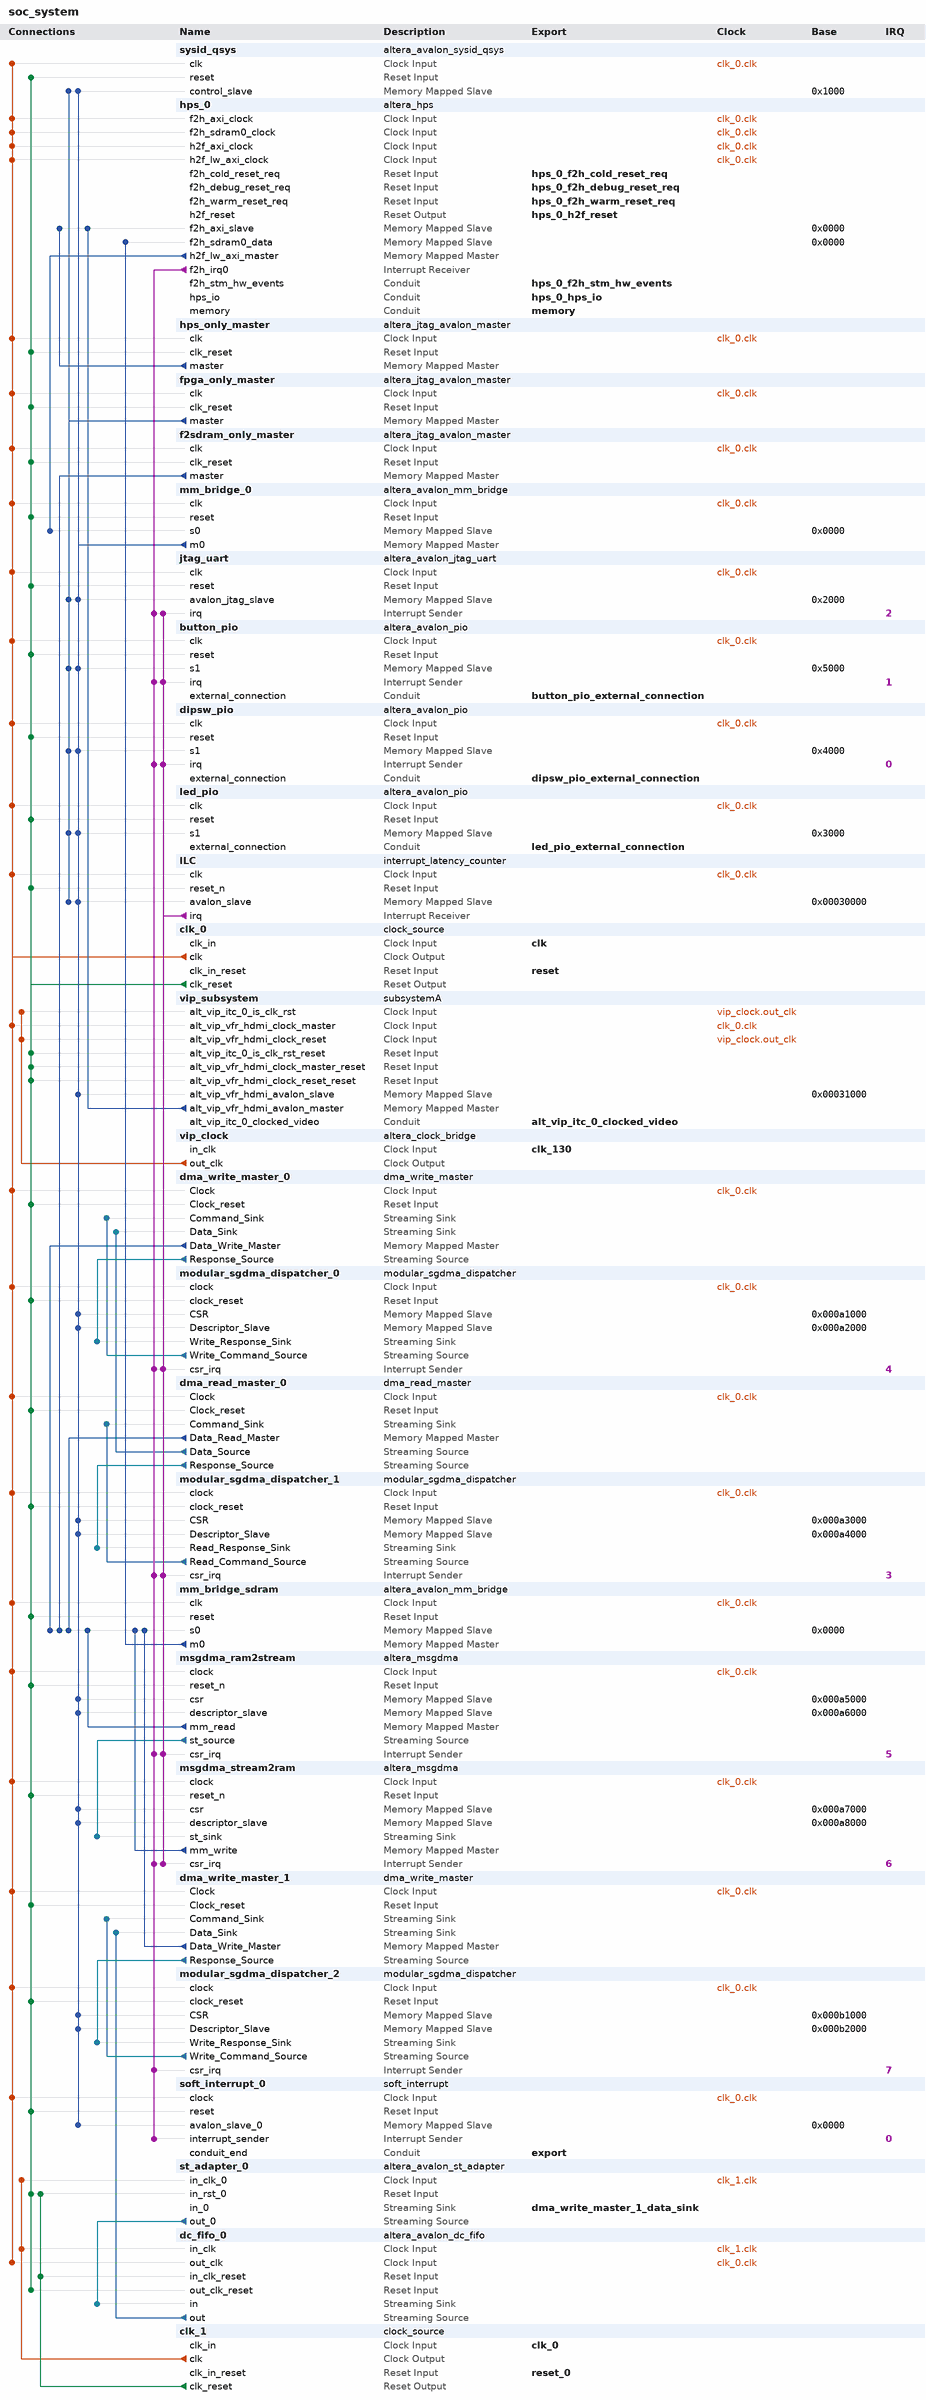
[diagram p0: system contents]
# Platform Designer (Qsys) system soc_system, Cyclone V 5CSEBA6U23I7
# Parameters at their usual value, and those the tool derives, are not listed.
package require -exact qsys 18.1
create_system soc_system
set_project_property DEVICE_FAMILY {Cyclone V}
set_project_property DEVICE 5CSEBA6U23I7

add_instance sysid_qsys altera_avalon_sysid_qsys 18.1
set_instance_parameter_value sysid_qsys id -1395322110

add_instance hps_0 altera_hps 18.1
set_instance_parameter_value hps_0 EMAC1_Mode RGMII
set_instance_parameter_value hps_0 EMAC1_PinMuxing {HPS I/O Set 0}
set_instance_parameter_value hps_0 F2SCLK_COLDRST_Enable true
set_instance_parameter_value hps_0 F2SCLK_DBGRST_Enable true
set_instance_parameter_value hps_0 F2SCLK_WARMRST_Enable true
set_instance_parameter_value hps_0 F2SDRAM_Type {Avalon-MM Bidirectional}
set_instance_parameter_value hps_0 F2SDRAM_Width 256
set_instance_parameter_value hps_0 F2SINTERRUPT_Enable true
set_instance_parameter_value hps_0 F2S_Width 3
set_instance_parameter_value hps_0 FPGA_PERIPHERAL_OUTPUT_CLOCK_FREQ_EMAC0_GTX_CLK 100
set_instance_parameter_value hps_0 FPGA_PERIPHERAL_OUTPUT_CLOCK_FREQ_EMAC0_MD_CLK 100.0
set_instance_parameter_value hps_0 FPGA_PERIPHERAL_OUTPUT_CLOCK_FREQ_EMAC1_GTX_CLK 100
set_instance_parameter_value hps_0 FPGA_PERIPHERAL_OUTPUT_CLOCK_FREQ_EMAC1_MD_CLK 100.0
set_instance_parameter_value hps_0 HPS_PROTOCOL DDR3
set_instance_parameter_value hps_0 I2C0_Mode I2C
set_instance_parameter_value hps_0 I2C0_PinMuxing {HPS I/O Set 0}
set_instance_parameter_value hps_0 I2C1_Mode I2C
set_instance_parameter_value hps_0 I2C1_PinMuxing {HPS I/O Set 0}
set_instance_parameter_value hps_0 LWH2F_Enable true
set_instance_parameter_value hps_0 MEM_BANKADDR_WIDTH 3
set_instance_parameter_value hps_0 MEM_CLK_FREQ 400.0
set_instance_parameter_value hps_0 MEM_COL_ADDR_WIDTH 10
set_instance_parameter_value hps_0 MEM_DQ_WIDTH 32
set_instance_parameter_value hps_0 MEM_DRV_STR RZQ/6
set_instance_parameter_value hps_0 MEM_ROW_ADDR_WIDTH 15
set_instance_parameter_value hps_0 MEM_RTT_NOM RZQ/6
set_instance_parameter_value hps_0 MEM_RTT_WR {Dynamic ODT off}
set_instance_parameter_value hps_0 MEM_TCL 7
set_instance_parameter_value hps_0 MEM_TFAW_NS 37.5
set_instance_parameter_value hps_0 MEM_TRAS_NS 35.0
set_instance_parameter_value hps_0 MEM_TRCD_NS 13.75
set_instance_parameter_value hps_0 MEM_TRFC_NS 300.0
set_instance_parameter_value hps_0 MEM_TRP_NS 13.75
set_instance_parameter_value hps_0 MEM_VENDOR Other
set_instance_parameter_value hps_0 MEM_WTCL 7
set_instance_parameter_value hps_0 QSPI_Mode N/A
set_instance_parameter_value hps_0 QSPI_PinMuxing Unused
set_instance_parameter_value hps_0 REF_CLK_FREQ 25.0
set_instance_parameter_value hps_0 S2FCLK_USER2CLK 4
set_instance_parameter_value hps_0 S2F_Width 2
set_instance_parameter_value hps_0 SDIO_Mode {4-bit Data}
set_instance_parameter_value hps_0 SDIO_PinMuxing {HPS I/O Set 0}
set_instance_parameter_value hps_0 SPIM1_Mode {Single Slave Select}
set_instance_parameter_value hps_0 SPIM1_PinMuxing {HPS I/O Set 0}
set_instance_parameter_value hps_0 STM_Enable true
set_instance_parameter_value hps_0 TIMING_BOARD_AC_SKEW 0.02
set_instance_parameter_value hps_0 TIMING_BOARD_AC_TO_CK_SKEW 0.0
set_instance_parameter_value hps_0 TIMING_BOARD_DQ_TO_DQS_SKEW 0.0
set_instance_parameter_value hps_0 TIMING_BOARD_MAX_CK_DELAY 0.6
set_instance_parameter_value hps_0 TIMING_BOARD_MAX_DQS_DELAY 0.6
set_instance_parameter_value hps_0 TIMING_BOARD_SKEW_BETWEEN_DQS 0.02
set_instance_parameter_value hps_0 TIMING_BOARD_SKEW_CKDQS_DIMM_MAX 0.01
set_instance_parameter_value hps_0 TIMING_BOARD_SKEW_CKDQS_DIMM_MIN -0.01
set_instance_parameter_value hps_0 TIMING_BOARD_SKEW_WITHIN_DQS 0.02
set_instance_parameter_value hps_0 TIMING_TDH 125
set_instance_parameter_value hps_0 TIMING_TDQSCK 400
set_instance_parameter_value hps_0 TIMING_TDQSQ 120
set_instance_parameter_value hps_0 TIMING_TDS 50
set_instance_parameter_value hps_0 TIMING_TIH 250
set_instance_parameter_value hps_0 TIMING_TIS 175
set_instance_parameter_value hps_0 TIMING_TQSH 0.38
set_instance_parameter_value hps_0 UART0_Mode {No Flow Control}
set_instance_parameter_value hps_0 UART0_PinMuxing {HPS I/O Set 0}
set_instance_parameter_value hps_0 USB1_Mode SDR
set_instance_parameter_value hps_0 USB1_PinMuxing {HPS I/O Set 0}
set_instance_parameter_value hps_0 desired_cfg_clk_mhz 100.0
set_instance_parameter_value hps_0 desired_qspi_clk_mhz 370.0

add_instance hps_only_master altera_jtag_avalon_master 18.1

add_instance fpga_only_master altera_jtag_avalon_master 18.1

add_instance f2sdram_only_master altera_jtag_avalon_master 18.1

add_instance mm_bridge_0 altera_avalon_mm_bridge 18.1
set_instance_parameter_value mm_bridge_0 ADDRESS_UNITS SYMBOLS
set_instance_parameter_value mm_bridge_0 ADDRESS_WIDTH 10
set_instance_parameter_value mm_bridge_0 DATA_WIDTH 32
set_instance_parameter_value mm_bridge_0 MAX_PENDING_RESPONSES 32
set_instance_parameter_value mm_bridge_0 USE_AUTO_ADDRESS_WIDTH 1

add_instance jtag_uart altera_avalon_jtag_uart 18.1
set_instance_parameter_value jtag_uart allowMultipleConnections true
set_instance_parameter_value jtag_uart simInteractiveOptions INTERACTIVE_ASCII_OUTPUT

add_instance button_pio altera_avalon_pio 18.1
set_instance_parameter_value button_pio bitClearingEdgeCapReg true
set_instance_parameter_value button_pio captureEdge true
set_instance_parameter_value button_pio direction Input
set_instance_parameter_value button_pio edgeType FALLING
set_instance_parameter_value button_pio generateIRQ true
set_instance_parameter_value button_pio irqType EDGE
set_instance_parameter_value button_pio width 2

add_instance dipsw_pio altera_avalon_pio 18.1
set_instance_parameter_value dipsw_pio bitClearingEdgeCapReg true
set_instance_parameter_value dipsw_pio captureEdge true
set_instance_parameter_value dipsw_pio direction Input
set_instance_parameter_value dipsw_pio edgeType ANY
set_instance_parameter_value dipsw_pio generateIRQ true
set_instance_parameter_value dipsw_pio irqType EDGE
set_instance_parameter_value dipsw_pio width 4

add_instance led_pio altera_avalon_pio 18.1
set_instance_parameter_value led_pio direction Output
set_instance_parameter_value led_pio resetValue 127
set_instance_parameter_value led_pio width 7

add_instance ILC interrupt_latency_counter 18.1
set_instance_parameter_value ILC CLOCK_RATE 100000000
set_instance_parameter_value ILC IRQ_PORT_CNT 7

add_instance clk_0 clock_source 18.1
set_instance_parameter_value clk_0 clockFrequency 100000000

add_instance vip_subsystem subsystemA 1.0

add_instance vip_clock altera_clock_bridge 18.1
set_instance_parameter_value vip_clock DERIVED_CLOCK_RATE 0
set_instance_parameter_value vip_clock EXPLICIT_CLOCK_RATE 0

add_instance dma_write_master_0 dma_write_master 18.1
set_instance_parameter_value dma_write_master_0 BURST_ENABLE 0
set_instance_parameter_value dma_write_master_0 DATA_WIDTH 256
set_instance_parameter_value dma_write_master_0 ERROR_ENABLE 0
set_instance_parameter_value dma_write_master_0 ERROR_WIDTH 8
set_instance_parameter_value dma_write_master_0 FIFO_DEPTH 32
set_instance_parameter_value dma_write_master_0 FIFO_SPEED_OPTIMIZATION 1
set_instance_parameter_value dma_write_master_0 FIX_ADDRESS_WIDTH 32
set_instance_parameter_value dma_write_master_0 GUI_BURST_WRAPPING_SUPPORT 0
set_instance_parameter_value dma_write_master_0 GUI_MAX_BURST_COUNT 2
set_instance_parameter_value dma_write_master_0 GUI_PROGRAMMABLE_BURST_ENABLE 0
set_instance_parameter_value dma_write_master_0 GUI_STRIDE_WIDTH 1
set_instance_parameter_value dma_write_master_0 LENGTH_WIDTH 32
set_instance_parameter_value dma_write_master_0 PACKET_ENABLE 1
set_instance_parameter_value dma_write_master_0 STRIDE_ENABLE 0
set_instance_parameter_value dma_write_master_0 TRANSFER_TYPE {Aligned Accesses}
set_instance_parameter_value dma_write_master_0 USE_FIX_ADDRESS_WIDTH 0

add_instance modular_sgdma_dispatcher_0 modular_sgdma_dispatcher 18.1
set_instance_parameter_value modular_sgdma_dispatcher_0 BURST_ENABLE 0
set_instance_parameter_value modular_sgdma_dispatcher_0 BURST_WRAPPING_SUPPORT 0
set_instance_parameter_value modular_sgdma_dispatcher_0 CSR_ADDRESS_WIDTH 3
set_instance_parameter_value modular_sgdma_dispatcher_0 DATA_FIFO_DEPTH 32
set_instance_parameter_value modular_sgdma_dispatcher_0 DATA_WIDTH 32
set_instance_parameter_value modular_sgdma_dispatcher_0 DESCRIPTOR_FIFO_DEPTH 128
set_instance_parameter_value modular_sgdma_dispatcher_0 ENHANCED_FEATURES 0
set_instance_parameter_value modular_sgdma_dispatcher_0 GUI_RESPONSE_PORT 2
set_instance_parameter_value modular_sgdma_dispatcher_0 MAX_BURST_COUNT 2
set_instance_parameter_value modular_sgdma_dispatcher_0 MAX_BYTE 1024
set_instance_parameter_value modular_sgdma_dispatcher_0 MAX_STRIDE 1
set_instance_parameter_value modular_sgdma_dispatcher_0 MODE 2
set_instance_parameter_value modular_sgdma_dispatcher_0 PREFETCHER_USE_CASE 0
set_instance_parameter_value modular_sgdma_dispatcher_0 PROGRAMMABLE_BURST_ENABLE 0
set_instance_parameter_value modular_sgdma_dispatcher_0 STRIDE_ENABLE 0
set_instance_parameter_value modular_sgdma_dispatcher_0 TRANSFER_TYPE {Aligned Accesses}

add_instance dma_read_master_0 dma_read_master 18.1
set_instance_parameter_value dma_read_master_0 BURST_ENABLE 0
set_instance_parameter_value dma_read_master_0 CHANNEL_ENABLE 0
set_instance_parameter_value dma_read_master_0 CHANNEL_WIDTH 8
set_instance_parameter_value dma_read_master_0 DATA_WIDTH 256
set_instance_parameter_value dma_read_master_0 ERROR_ENABLE 0
set_instance_parameter_value dma_read_master_0 ERROR_WIDTH 8
set_instance_parameter_value dma_read_master_0 FIFO_DEPTH 32
set_instance_parameter_value dma_read_master_0 FIFO_SPEED_OPTIMIZATION 1
set_instance_parameter_value dma_read_master_0 FIX_ADDRESS_WIDTH 32
set_instance_parameter_value dma_read_master_0 GUI_BURST_WRAPPING_SUPPORT 0
set_instance_parameter_value dma_read_master_0 GUI_MAX_BURST_COUNT 2
set_instance_parameter_value dma_read_master_0 GUI_PROGRAMMABLE_BURST_ENABLE 0
set_instance_parameter_value dma_read_master_0 GUI_STRIDE_WIDTH 1
set_instance_parameter_value dma_read_master_0 LENGTH_WIDTH 32
set_instance_parameter_value dma_read_master_0 PACKET_ENABLE 1
set_instance_parameter_value dma_read_master_0 STRIDE_ENABLE 0
set_instance_parameter_value dma_read_master_0 TRANSFER_TYPE {Aligned Accesses}
set_instance_parameter_value dma_read_master_0 USE_FIX_ADDRESS_WIDTH 0

add_instance modular_sgdma_dispatcher_1 modular_sgdma_dispatcher 18.1
set_instance_parameter_value modular_sgdma_dispatcher_1 BURST_ENABLE 0
set_instance_parameter_value modular_sgdma_dispatcher_1 BURST_WRAPPING_SUPPORT 0
set_instance_parameter_value modular_sgdma_dispatcher_1 CSR_ADDRESS_WIDTH 3
set_instance_parameter_value modular_sgdma_dispatcher_1 DATA_FIFO_DEPTH 32
set_instance_parameter_value modular_sgdma_dispatcher_1 DATA_WIDTH 32
set_instance_parameter_value modular_sgdma_dispatcher_1 DESCRIPTOR_FIFO_DEPTH 256
set_instance_parameter_value modular_sgdma_dispatcher_1 ENHANCED_FEATURES 1
set_instance_parameter_value modular_sgdma_dispatcher_1 GUI_RESPONSE_PORT 0
set_instance_parameter_value modular_sgdma_dispatcher_1 MAX_BURST_COUNT 2
set_instance_parameter_value modular_sgdma_dispatcher_1 MAX_BYTE 1024
set_instance_parameter_value modular_sgdma_dispatcher_1 MAX_STRIDE 1
set_instance_parameter_value modular_sgdma_dispatcher_1 MODE 1
set_instance_parameter_value modular_sgdma_dispatcher_1 PREFETCHER_USE_CASE 0
set_instance_parameter_value modular_sgdma_dispatcher_1 PROGRAMMABLE_BURST_ENABLE 0
set_instance_parameter_value modular_sgdma_dispatcher_1 STRIDE_ENABLE 0
set_instance_parameter_value modular_sgdma_dispatcher_1 TRANSFER_TYPE {Aligned Accesses}

add_instance mm_bridge_sdram altera_avalon_mm_bridge 18.1
set_instance_parameter_value mm_bridge_sdram ADDRESS_UNITS SYMBOLS
set_instance_parameter_value mm_bridge_sdram ADDRESS_WIDTH 10
set_instance_parameter_value mm_bridge_sdram DATA_WIDTH 256
set_instance_parameter_value mm_bridge_sdram MAX_PENDING_RESPONSES 8
set_instance_parameter_value mm_bridge_sdram USE_AUTO_ADDRESS_WIDTH 1

add_instance msgdma_ram2stream altera_msgdma 18.1
set_instance_parameter_value msgdma_ram2stream BURST_ENABLE 1
set_instance_parameter_value msgdma_ram2stream DATA_FIFO_DEPTH 256
set_instance_parameter_value msgdma_ram2stream DATA_WIDTH 256
set_instance_parameter_value msgdma_ram2stream DESCRIPTOR_FIFO_DEPTH 128
set_instance_parameter_value msgdma_ram2stream ENHANCED_FEATURES 0
set_instance_parameter_value msgdma_ram2stream ERROR_ENABLE 1
set_instance_parameter_value msgdma_ram2stream ERROR_WIDTH 2
set_instance_parameter_value msgdma_ram2stream MAX_BURST_COUNT 16
set_instance_parameter_value msgdma_ram2stream MAX_BYTE 1048576
set_instance_parameter_value msgdma_ram2stream MODE 1
set_instance_parameter_value msgdma_ram2stream PACKET_ENABLE 1
set_instance_parameter_value msgdma_ram2stream PROGRAMMABLE_BURST_ENABLE 1
set_instance_parameter_value msgdma_ram2stream TRANSFER_TYPE {Aligned Accesses}

add_instance msgdma_stream2ram altera_msgdma 18.1
set_instance_parameter_value msgdma_stream2ram BURST_ENABLE 1
set_instance_parameter_value msgdma_stream2ram DATA_FIFO_DEPTH 256
set_instance_parameter_value msgdma_stream2ram DATA_WIDTH 256
set_instance_parameter_value msgdma_stream2ram DESCRIPTOR_FIFO_DEPTH 128
set_instance_parameter_value msgdma_stream2ram ENHANCED_FEATURES 0
set_instance_parameter_value msgdma_stream2ram ERROR_ENABLE 1
set_instance_parameter_value msgdma_stream2ram ERROR_WIDTH 2
set_instance_parameter_value msgdma_stream2ram MAX_BURST_COUNT 16
set_instance_parameter_value msgdma_stream2ram MAX_BYTE 1048576
set_instance_parameter_value msgdma_stream2ram MODE 2
set_instance_parameter_value msgdma_stream2ram PACKET_ENABLE 1
set_instance_parameter_value msgdma_stream2ram PROGRAMMABLE_BURST_ENABLE 1
set_instance_parameter_value msgdma_stream2ram TRANSFER_TYPE {Aligned Accesses}

add_instance dma_write_master_1 dma_write_master 18.1
set_instance_parameter_value dma_write_master_1 BURST_ENABLE 1
set_instance_parameter_value dma_write_master_1 DATA_WIDTH 256
set_instance_parameter_value dma_write_master_1 ERROR_ENABLE 0
set_instance_parameter_value dma_write_master_1 ERROR_WIDTH 8
set_instance_parameter_value dma_write_master_1 FIFO_DEPTH 1024
set_instance_parameter_value dma_write_master_1 FIFO_SPEED_OPTIMIZATION 1
set_instance_parameter_value dma_write_master_1 FIX_ADDRESS_WIDTH 32
set_instance_parameter_value dma_write_master_1 GUI_BURST_WRAPPING_SUPPORT 0
set_instance_parameter_value dma_write_master_1 GUI_MAX_BURST_COUNT 256
set_instance_parameter_value dma_write_master_1 GUI_PROGRAMMABLE_BURST_ENABLE 0
set_instance_parameter_value dma_write_master_1 GUI_STRIDE_WIDTH 1
set_instance_parameter_value dma_write_master_1 LENGTH_WIDTH 32
set_instance_parameter_value dma_write_master_1 PACKET_ENABLE 1
set_instance_parameter_value dma_write_master_1 STRIDE_ENABLE 0
set_instance_parameter_value dma_write_master_1 TRANSFER_TYPE {Aligned Accesses}
set_instance_parameter_value dma_write_master_1 USE_FIX_ADDRESS_WIDTH 0

add_instance modular_sgdma_dispatcher_2 modular_sgdma_dispatcher 18.1
set_instance_parameter_value modular_sgdma_dispatcher_2 BURST_ENABLE 0
set_instance_parameter_value modular_sgdma_dispatcher_2 BURST_WRAPPING_SUPPORT 0
set_instance_parameter_value modular_sgdma_dispatcher_2 CSR_ADDRESS_WIDTH 3
set_instance_parameter_value modular_sgdma_dispatcher_2 DATA_FIFO_DEPTH 32
set_instance_parameter_value modular_sgdma_dispatcher_2 DATA_WIDTH 32
set_instance_parameter_value modular_sgdma_dispatcher_2 DESCRIPTOR_FIFO_DEPTH 128
set_instance_parameter_value modular_sgdma_dispatcher_2 ENHANCED_FEATURES 0
set_instance_parameter_value modular_sgdma_dispatcher_2 GUI_RESPONSE_PORT 2
set_instance_parameter_value modular_sgdma_dispatcher_2 MAX_BURST_COUNT 2
set_instance_parameter_value modular_sgdma_dispatcher_2 MAX_BYTE 1024
set_instance_parameter_value modular_sgdma_dispatcher_2 MAX_STRIDE 1
set_instance_parameter_value modular_sgdma_dispatcher_2 MODE 2
set_instance_parameter_value modular_sgdma_dispatcher_2 PREFETCHER_USE_CASE 0
set_instance_parameter_value modular_sgdma_dispatcher_2 PROGRAMMABLE_BURST_ENABLE 0
set_instance_parameter_value modular_sgdma_dispatcher_2 STRIDE_ENABLE 0
set_instance_parameter_value modular_sgdma_dispatcher_2 TRANSFER_TYPE {Aligned Accesses}

add_instance soft_interrupt_0 soft_interrupt 1.0

add_instance st_adapter_0 altera_avalon_st_adapter 18.1
set_instance_parameter_value st_adapter_0 inBitsPerSymbol 8
set_instance_parameter_value st_adapter_0 inChannelWidth 0
set_instance_parameter_value st_adapter_0 inDataWidth 64
set_instance_parameter_value st_adapter_0 inErrorWidth 0
set_instance_parameter_value st_adapter_0 inMaxChannel 0
set_instance_parameter_value st_adapter_0 inReadyLatency 0
set_instance_parameter_value st_adapter_0 inUseEmptyPort 0
set_instance_parameter_value st_adapter_0 inUsePackets 1
set_instance_parameter_value st_adapter_0 inUseReady 1
set_instance_parameter_value st_adapter_0 inUseValid 1
set_instance_parameter_value st_adapter_0 outChannelWidth 0
set_instance_parameter_value st_adapter_0 outDataWidth 256
set_instance_parameter_value st_adapter_0 outErrorWidth 0
set_instance_parameter_value st_adapter_0 outMaxChannel 0
set_instance_parameter_value st_adapter_0 outReadyLatency 0
set_instance_parameter_value st_adapter_0 outUseEmptyPort 1
set_instance_parameter_value st_adapter_0 outUseReady 1
set_instance_parameter_value st_adapter_0 outUseValid 1

add_instance dc_fifo_0 altera_avalon_dc_fifo 18.1
set_instance_parameter_value dc_fifo_0 BITS_PER_SYMBOL 8
set_instance_parameter_value dc_fifo_0 FIFO_DEPTH 16
set_instance_parameter_value dc_fifo_0 SYMBOLS_PER_BEAT 32
set_instance_parameter_value dc_fifo_0 USE_PACKETS 1

add_instance clk_1 clock_source 18.1
set_instance_parameter_value clk_1 clockFrequency 200000000

# connections
add_connection clk_0.clk button_pio.clk clock
add_connection clk_0.clk dc_fifo_0.out_clk clock
add_connection clk_0.clk dipsw_pio.clk clock
add_connection clk_0.clk dma_read_master_0.Clock clock
add_connection clk_0.clk dma_write_master_0.Clock clock
add_connection clk_0.clk dma_write_master_1.Clock clock
add_connection clk_0.clk f2sdram_only_master.clk clock
add_connection clk_0.clk fpga_only_master.clk clock
add_connection clk_0.clk hps_0.f2h_axi_clock clock
add_connection clk_0.clk hps_0.f2h_sdram0_clock clock
add_connection clk_0.clk hps_0.h2f_axi_clock clock
add_connection clk_0.clk hps_0.h2f_lw_axi_clock clock
add_connection clk_0.clk hps_only_master.clk clock
add_connection clk_0.clk ILC.clk clock
add_connection clk_0.clk jtag_uart.clk clock
add_connection clk_0.clk led_pio.clk clock
add_connection clk_0.clk mm_bridge_0.clk clock
add_connection clk_0.clk mm_bridge_sdram.clk clock
add_connection clk_0.clk modular_sgdma_dispatcher_0.clock clock
add_connection clk_0.clk modular_sgdma_dispatcher_1.clock clock
add_connection clk_0.clk modular_sgdma_dispatcher_2.clock clock
add_connection clk_0.clk msgdma_ram2stream.clock clock
add_connection clk_0.clk msgdma_stream2ram.clock clock
add_connection clk_0.clk soft_interrupt_0.clock clock
add_connection clk_0.clk sysid_qsys.clk clock
add_connection clk_0.clk vip_subsystem.alt_vip_vfr_hdmi_clock_master clock
add_connection clk_1.clk dc_fifo_0.in_clk clock
add_connection clk_1.clk st_adapter_0.in_clk_0 clock
add_connection vip_clock.out_clk vip_subsystem.alt_vip_itc_0_is_clk_rst clock
add_connection vip_clock.out_clk vip_subsystem.alt_vip_vfr_hdmi_clock_reset clock
add_connection clk_0.clk_reset button_pio.reset reset
add_connection clk_0.clk_reset dc_fifo_0.out_clk_reset reset
add_connection clk_0.clk_reset dipsw_pio.reset reset
add_connection clk_0.clk_reset dma_read_master_0.Clock_reset reset
add_connection clk_0.clk_reset dma_write_master_0.Clock_reset reset
add_connection clk_0.clk_reset dma_write_master_1.Clock_reset reset
add_connection clk_0.clk_reset f2sdram_only_master.clk_reset reset
add_connection clk_0.clk_reset fpga_only_master.clk_reset reset
add_connection clk_0.clk_reset hps_only_master.clk_reset reset
add_connection clk_0.clk_reset ILC.reset_n reset
add_connection clk_0.clk_reset jtag_uart.reset reset
add_connection clk_0.clk_reset led_pio.reset reset
add_connection clk_0.clk_reset mm_bridge_0.reset reset
add_connection clk_0.clk_reset mm_bridge_sdram.reset reset
add_connection clk_0.clk_reset modular_sgdma_dispatcher_0.clock_reset reset
add_connection clk_0.clk_reset modular_sgdma_dispatcher_1.clock_reset reset
add_connection clk_0.clk_reset modular_sgdma_dispatcher_2.clock_reset reset
add_connection clk_0.clk_reset msgdma_ram2stream.reset_n reset
add_connection clk_0.clk_reset msgdma_stream2ram.reset_n reset
add_connection clk_0.clk_reset soft_interrupt_0.reset reset
add_connection clk_0.clk_reset st_adapter_0.in_rst_0 reset
add_connection clk_0.clk_reset sysid_qsys.reset reset
add_connection clk_0.clk_reset vip_subsystem.alt_vip_itc_0_is_clk_rst_reset reset
add_connection clk_0.clk_reset vip_subsystem.alt_vip_vfr_hdmi_clock_master_reset reset
add_connection clk_0.clk_reset vip_subsystem.alt_vip_vfr_hdmi_clock_reset_reset reset
add_connection clk_1.clk_reset dc_fifo_0.in_clk_reset reset
add_connection clk_1.clk_reset st_adapter_0.in_rst_0 reset
add_connection dma_read_master_0.Data_Read_Master mm_bridge_sdram.s0 avalon
set_connection_parameter_value dma_read_master_0.Data_Read_Master/mm_bridge_sdram.s0 baseAddress 0x0000
add_connection dma_write_master_0.Data_Write_Master mm_bridge_sdram.s0 avalon
set_connection_parameter_value dma_write_master_0.Data_Write_Master/mm_bridge_sdram.s0 baseAddress 0x0000
add_connection dma_write_master_1.Data_Write_Master mm_bridge_sdram.s0 avalon
set_connection_parameter_value dma_write_master_1.Data_Write_Master/mm_bridge_sdram.s0 baseAddress 0x0000
add_connection f2sdram_only_master.master mm_bridge_sdram.s0 avalon
set_connection_parameter_value f2sdram_only_master.master/mm_bridge_sdram.s0 baseAddress 0x0000
add_connection fpga_only_master.master button_pio.s1 avalon
set_connection_parameter_value fpga_only_master.master/button_pio.s1 baseAddress 0x5000
add_connection fpga_only_master.master dipsw_pio.s1 avalon
set_connection_parameter_value fpga_only_master.master/dipsw_pio.s1 baseAddress 0x4000
add_connection fpga_only_master.master ILC.avalon_slave avalon
set_connection_parameter_value fpga_only_master.master/ILC.avalon_slave baseAddress 0x00030000
add_connection fpga_only_master.master jtag_uart.avalon_jtag_slave avalon
set_connection_parameter_value fpga_only_master.master/jtag_uart.avalon_jtag_slave baseAddress 0x2000
add_connection fpga_only_master.master led_pio.s1 avalon
set_connection_parameter_value fpga_only_master.master/led_pio.s1 baseAddress 0x3000
add_connection fpga_only_master.master sysid_qsys.control_slave avalon
set_connection_parameter_value fpga_only_master.master/sysid_qsys.control_slave baseAddress 0x1000
add_connection hps_0.h2f_lw_axi_master mm_bridge_0.s0 avalon
set_connection_parameter_value hps_0.h2f_lw_axi_master/mm_bridge_0.s0 baseAddress 0x0000
add_connection hps_only_master.master hps_0.f2h_axi_slave avalon
set_connection_parameter_value hps_only_master.master/hps_0.f2h_axi_slave baseAddress 0x0000
add_connection mm_bridge_0.m0 button_pio.s1 avalon
set_connection_parameter_value mm_bridge_0.m0/button_pio.s1 baseAddress 0x5000
add_connection mm_bridge_0.m0 dipsw_pio.s1 avalon
set_connection_parameter_value mm_bridge_0.m0/dipsw_pio.s1 baseAddress 0x4000
add_connection mm_bridge_0.m0 ILC.avalon_slave avalon
set_connection_parameter_value mm_bridge_0.m0/ILC.avalon_slave baseAddress 0x00030000
add_connection mm_bridge_0.m0 jtag_uart.avalon_jtag_slave avalon
set_connection_parameter_value mm_bridge_0.m0/jtag_uart.avalon_jtag_slave baseAddress 0x2000
add_connection mm_bridge_0.m0 led_pio.s1 avalon
set_connection_parameter_value mm_bridge_0.m0/led_pio.s1 baseAddress 0x3000
add_connection mm_bridge_0.m0 modular_sgdma_dispatcher_0.CSR avalon
set_connection_parameter_value mm_bridge_0.m0/modular_sgdma_dispatcher_0.CSR baseAddress 0x000a1000
add_connection mm_bridge_0.m0 modular_sgdma_dispatcher_0.Descriptor_Slave avalon
set_connection_parameter_value mm_bridge_0.m0/modular_sgdma_dispatcher_0.Descriptor_Slave baseAddress 0x000a2000
add_connection mm_bridge_0.m0 modular_sgdma_dispatcher_1.CSR avalon
set_connection_parameter_value mm_bridge_0.m0/modular_sgdma_dispatcher_1.CSR baseAddress 0x000a3000
add_connection mm_bridge_0.m0 modular_sgdma_dispatcher_1.Descriptor_Slave avalon
set_connection_parameter_value mm_bridge_0.m0/modular_sgdma_dispatcher_1.Descriptor_Slave baseAddress 0x000a4000
add_connection mm_bridge_0.m0 modular_sgdma_dispatcher_2.CSR avalon
set_connection_parameter_value mm_bridge_0.m0/modular_sgdma_dispatcher_2.CSR baseAddress 0x000b1000
add_connection mm_bridge_0.m0 modular_sgdma_dispatcher_2.Descriptor_Slave avalon
set_connection_parameter_value mm_bridge_0.m0/modular_sgdma_dispatcher_2.Descriptor_Slave baseAddress 0x000b2000
add_connection mm_bridge_0.m0 msgdma_ram2stream.csr avalon
set_connection_parameter_value mm_bridge_0.m0/msgdma_ram2stream.csr baseAddress 0x000a5000
add_connection mm_bridge_0.m0 msgdma_ram2stream.descriptor_slave avalon
set_connection_parameter_value mm_bridge_0.m0/msgdma_ram2stream.descriptor_slave baseAddress 0x000a6000
add_connection mm_bridge_0.m0 msgdma_stream2ram.csr avalon
set_connection_parameter_value mm_bridge_0.m0/msgdma_stream2ram.csr baseAddress 0x000a7000
add_connection mm_bridge_0.m0 msgdma_stream2ram.descriptor_slave avalon
set_connection_parameter_value mm_bridge_0.m0/msgdma_stream2ram.descriptor_slave baseAddress 0x000a8000
add_connection mm_bridge_0.m0 soft_interrupt_0.avalon_slave_0 avalon
set_connection_parameter_value mm_bridge_0.m0/soft_interrupt_0.avalon_slave_0 baseAddress 0x0000
add_connection mm_bridge_0.m0 sysid_qsys.control_slave avalon
set_connection_parameter_value mm_bridge_0.m0/sysid_qsys.control_slave baseAddress 0x1000
add_connection mm_bridge_0.m0 vip_subsystem.alt_vip_vfr_hdmi_avalon_slave avalon
set_connection_parameter_value mm_bridge_0.m0/vip_subsystem.alt_vip_vfr_hdmi_avalon_slave baseAddress 0x00031000
add_connection mm_bridge_sdram.m0 hps_0.f2h_sdram0_data avalon
set_connection_parameter_value mm_bridge_sdram.m0/hps_0.f2h_sdram0_data baseAddress 0x0000
add_connection msgdma_ram2stream.mm_read mm_bridge_sdram.s0 avalon
set_connection_parameter_value msgdma_ram2stream.mm_read/mm_bridge_sdram.s0 baseAddress 0x0000
add_connection msgdma_stream2ram.mm_write mm_bridge_sdram.s0 avalon
set_connection_parameter_value msgdma_stream2ram.mm_write/mm_bridge_sdram.s0 baseAddress 0x0000
add_connection vip_subsystem.alt_vip_vfr_hdmi_avalon_master hps_0.f2h_axi_slave avalon
set_connection_parameter_value vip_subsystem.alt_vip_vfr_hdmi_avalon_master/hps_0.f2h_axi_slave baseAddress 0x0000
add_connection dc_fifo_0.out dma_write_master_1.Data_Sink avalon_streaming
add_connection dma_read_master_0.Data_Source dma_write_master_0.Data_Sink avalon_streaming
add_connection dma_read_master_0.Response_Source modular_sgdma_dispatcher_1.Read_Response_Sink avalon_streaming
add_connection dma_write_master_0.Response_Source modular_sgdma_dispatcher_0.Write_Response_Sink avalon_streaming
add_connection dma_write_master_1.Response_Source modular_sgdma_dispatcher_2.Write_Response_Sink avalon_streaming
add_connection modular_sgdma_dispatcher_0.Write_Command_Source dma_write_master_0.Command_Sink avalon_streaming
add_connection modular_sgdma_dispatcher_1.Read_Command_Source dma_read_master_0.Command_Sink avalon_streaming
add_connection modular_sgdma_dispatcher_2.Write_Command_Source dma_write_master_1.Command_Sink avalon_streaming
add_connection msgdma_ram2stream.st_source msgdma_stream2ram.st_sink avalon_streaming
add_connection st_adapter_0.out_0 dc_fifo_0.in avalon_streaming
add_connection hps_0.f2h_irq0 button_pio.irq interrupt
set_connection_parameter_value hps_0.f2h_irq0/button_pio.irq irqNumber 1
add_connection hps_0.f2h_irq0 dipsw_pio.irq interrupt
set_connection_parameter_value hps_0.f2h_irq0/dipsw_pio.irq irqNumber 9
add_connection hps_0.f2h_irq0 jtag_uart.irq interrupt
set_connection_parameter_value hps_0.f2h_irq0/jtag_uart.irq irqNumber 2
add_connection hps_0.f2h_irq0 modular_sgdma_dispatcher_0.csr_irq interrupt
set_connection_parameter_value hps_0.f2h_irq0/modular_sgdma_dispatcher_0.csr_irq irqNumber 4
add_connection hps_0.f2h_irq0 modular_sgdma_dispatcher_1.csr_irq interrupt
set_connection_parameter_value hps_0.f2h_irq0/modular_sgdma_dispatcher_1.csr_irq irqNumber 3
add_connection hps_0.f2h_irq0 modular_sgdma_dispatcher_2.csr_irq interrupt
set_connection_parameter_value hps_0.f2h_irq0/modular_sgdma_dispatcher_2.csr_irq irqNumber 7
add_connection hps_0.f2h_irq0 msgdma_ram2stream.csr_irq interrupt
set_connection_parameter_value hps_0.f2h_irq0/msgdma_ram2stream.csr_irq irqNumber 5
add_connection hps_0.f2h_irq0 msgdma_stream2ram.csr_irq interrupt
set_connection_parameter_value hps_0.f2h_irq0/msgdma_stream2ram.csr_irq irqNumber 6
add_connection hps_0.f2h_irq0 soft_interrupt_0.interrupt_sender interrupt
set_connection_parameter_value hps_0.f2h_irq0/soft_interrupt_0.interrupt_sender irqNumber 0
add_connection ILC.irq button_pio.irq interrupt
set_connection_parameter_value ILC.irq/button_pio.irq irqNumber 1
add_connection ILC.irq dipsw_pio.irq interrupt
set_connection_parameter_value ILC.irq/dipsw_pio.irq irqNumber 0
add_connection ILC.irq jtag_uart.irq interrupt
set_connection_parameter_value ILC.irq/jtag_uart.irq irqNumber 2
add_connection ILC.irq modular_sgdma_dispatcher_0.csr_irq interrupt
set_connection_parameter_value ILC.irq/modular_sgdma_dispatcher_0.csr_irq irqNumber 4
add_connection ILC.irq modular_sgdma_dispatcher_1.csr_irq interrupt
set_connection_parameter_value ILC.irq/modular_sgdma_dispatcher_1.csr_irq irqNumber 3
add_connection ILC.irq msgdma_ram2stream.csr_irq interrupt
set_connection_parameter_value ILC.irq/msgdma_ram2stream.csr_irq irqNumber 5
add_connection ILC.irq msgdma_stream2ram.csr_irq interrupt
set_connection_parameter_value ILC.irq/msgdma_stream2ram.csr_irq irqNumber 6

# exported interfaces
add_interface alt_vip_itc_0_clocked_video conduit end
set_interface_property alt_vip_itc_0_clocked_video EXPORT_OF vip_subsystem.alt_vip_itc_0_clocked_video
add_interface button_pio_external_connection conduit end
set_interface_property button_pio_external_connection EXPORT_OF button_pio.external_connection
add_interface clk clock sink
set_interface_property clk EXPORT_OF clk_0.clk_in
add_interface clk_0 clock sink
set_interface_property clk_0 EXPORT_OF clk_1.clk_in
add_interface clk_130 clock sink
set_interface_property clk_130 EXPORT_OF vip_clock.in_clk
add_interface dipsw_pio_external_connection conduit end
set_interface_property dipsw_pio_external_connection EXPORT_OF dipsw_pio.external_connection
add_interface dma_write_master_1_data_sink avalon_streaming sink
set_interface_property dma_write_master_1_data_sink EXPORT_OF st_adapter_0.in_0
add_interface export conduit end
set_interface_property export EXPORT_OF soft_interrupt_0.conduit_end
add_interface hps_0_f2h_cold_reset_req reset sink
set_interface_property hps_0_f2h_cold_reset_req EXPORT_OF hps_0.f2h_cold_reset_req
add_interface hps_0_f2h_debug_reset_req reset sink
set_interface_property hps_0_f2h_debug_reset_req EXPORT_OF hps_0.f2h_debug_reset_req
add_interface hps_0_f2h_stm_hw_events conduit end
set_interface_property hps_0_f2h_stm_hw_events EXPORT_OF hps_0.f2h_stm_hw_events
add_interface hps_0_f2h_warm_reset_req reset sink
set_interface_property hps_0_f2h_warm_reset_req EXPORT_OF hps_0.f2h_warm_reset_req
add_interface hps_0_h2f_reset reset source
set_interface_property hps_0_h2f_reset EXPORT_OF hps_0.h2f_reset
add_interface hps_0_hps_io conduit end
set_interface_property hps_0_hps_io EXPORT_OF hps_0.hps_io
add_interface led_pio_external_connection conduit end
set_interface_property led_pio_external_connection EXPORT_OF led_pio.external_connection
add_interface memory conduit end
set_interface_property memory EXPORT_OF hps_0.memory
add_interface reset reset sink
set_interface_property reset EXPORT_OF clk_0.clk_in_reset
add_interface reset_0 reset sink
set_interface_property reset_0 EXPORT_OF clk_1.clk_in_reset

set_interconnect_requirement {$system} qsys_mm.clockCrossingAdapter HANDSHAKE
set_interconnect_requirement {$system} qsys_mm.maxAdditionalLatency 1

save_system soc_system.qsys
